# EAGLE design A slave stm32 (EAGLE 9.5.1)
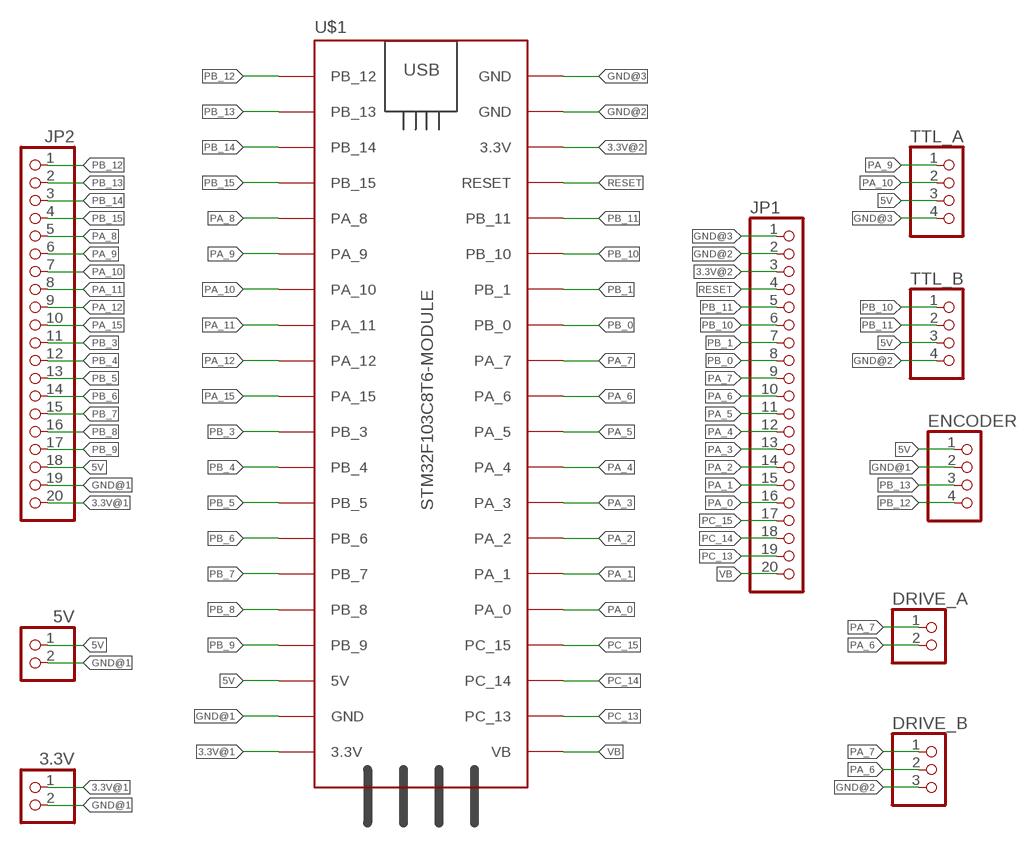
[diagram p0: schematic, sheet 1]

## Parts
3.3V  PINHD-2_DATA  [1X02_DATA]
5V  PINHD-2_DATA  [1X02_DATA]
DRIVE_A  PINHD-2_DATA  [1X02_DATA]
DRIVE_B  PINHD-3_DATA  [1X03_DATA]
ENCODER  PINHD-4_DATA  [1X04_DATA]
JP1  PINHD-1X20  [1X20]
JP2  PINHD-1X20  [1X20]
TTL_A  PINHD-4_DATA  [1X04_DATA]
TTL_B  PINHD-4_DATA  [1X04_DATA]
U$1  STM32F103C8T6-MODULE  [STM32F103C8T6-MODULE]

## Nets
3.3V@1: 3.3V.1 JP2.20 U$1.3.3V_1(3.3V)
3.3V@2: JP1.3 U$1.3.3V_2(3.3V)
5V: 5V.1 ENCODER.1 JP2.18 TTL_A.3 TTL_B.3 U$1.5V
GND@1: 3.3V.2 5V.2 ENCODER.2 JP2.19 U$1.GND_1(GND)
GND@2: DRIVE_B.3 JP1.2 TTL_B.4 U$1.GND_2(GND)
GND@3: JP1.1 TTL_A.4 U$1.GND_3(GND)
PA_0: JP1.16 U$1.PA_0
PA_1: JP1.15 U$1.PA_1
PA_2: JP1.14 U$1.PA_2
PA_3: JP1.13 U$1.PA_3
PA_4: JP1.12 U$1.PA_4
PA_5: JP1.11 U$1.PA_5
PA_6: DRIVE_A.2 DRIVE_B.2 JP1.10 U$1.PA_6
PA_7: DRIVE_A.1 DRIVE_B.1 JP1.9 U$1.PA_7
PA_8: JP2.5 U$1.PA_8
PA_9: JP2.6 TTL_A.1 U$1.PA_9
PA_10: JP2.7 TTL_A.2 U$1.PA_10
PA_11: JP2.8 U$1.PA_11
PA_12: JP2.9 U$1.PA_12
PA_15: JP2.10 U$1.PA_15
PB_0: JP1.8 U$1.PB_0
PB_1: JP1.7 U$1.PB_1
PB_3: JP2.11 U$1.PB_3
PB_4: JP2.12 U$1.PB_4
PB_5: JP2.13 U$1.PB_5
PB_6: JP2.14 U$1.PB_6
PB_7: JP2.15 U$1.PB_7
PB_8: JP2.16 U$1.PB_8
PB_9: JP2.17 U$1.PB_9
PB_10: JP1.6 TTL_B.1 U$1.PB_10
PB_11: JP1.5 TTL_B.2 U$1.PB_11
PB_12: ENCODER.4 JP2.1 U$1.PB_12
PB_13: ENCODER.3 JP2.2 U$1.PB_13
PB_14: JP2.3 U$1.PB_14
PB_15: JP2.4 U$1.PB_15
PC_13: JP1.19 U$1.PC_13
PC_14: JP1.18 U$1.PC_14
PC_15: JP1.17 U$1.PC_15
RESET: JP1.4 U$1.RESET
VB: JP1.20 U$1.VB

## Library data of the parts
3.3V 5V DRIVE_A = MIA_LIBRARY-2-2-2:PINHD-2_DATA: PIN HEADER
DRIVE_B = MIA_LIBRARY-2-2-2:PINHD-3_DATA: PIN HEADER
ENCODER TTL_A TTL_B = MIA_LIBRARY-2-2-2:PINHD-4_DATA: PIN HEADER
JP1 JP2 = MIA_LIBRARY-2-2-2:PINHD-1X20: PIN HEADER
U$1 = MIA_LIBRARY-2-2-2:STM32F103C8T6-MODULE: STM32F103C8T6 module with ARM Cortex-3, 20kB SRAM, 64kB Flash, 72MHz

## Board
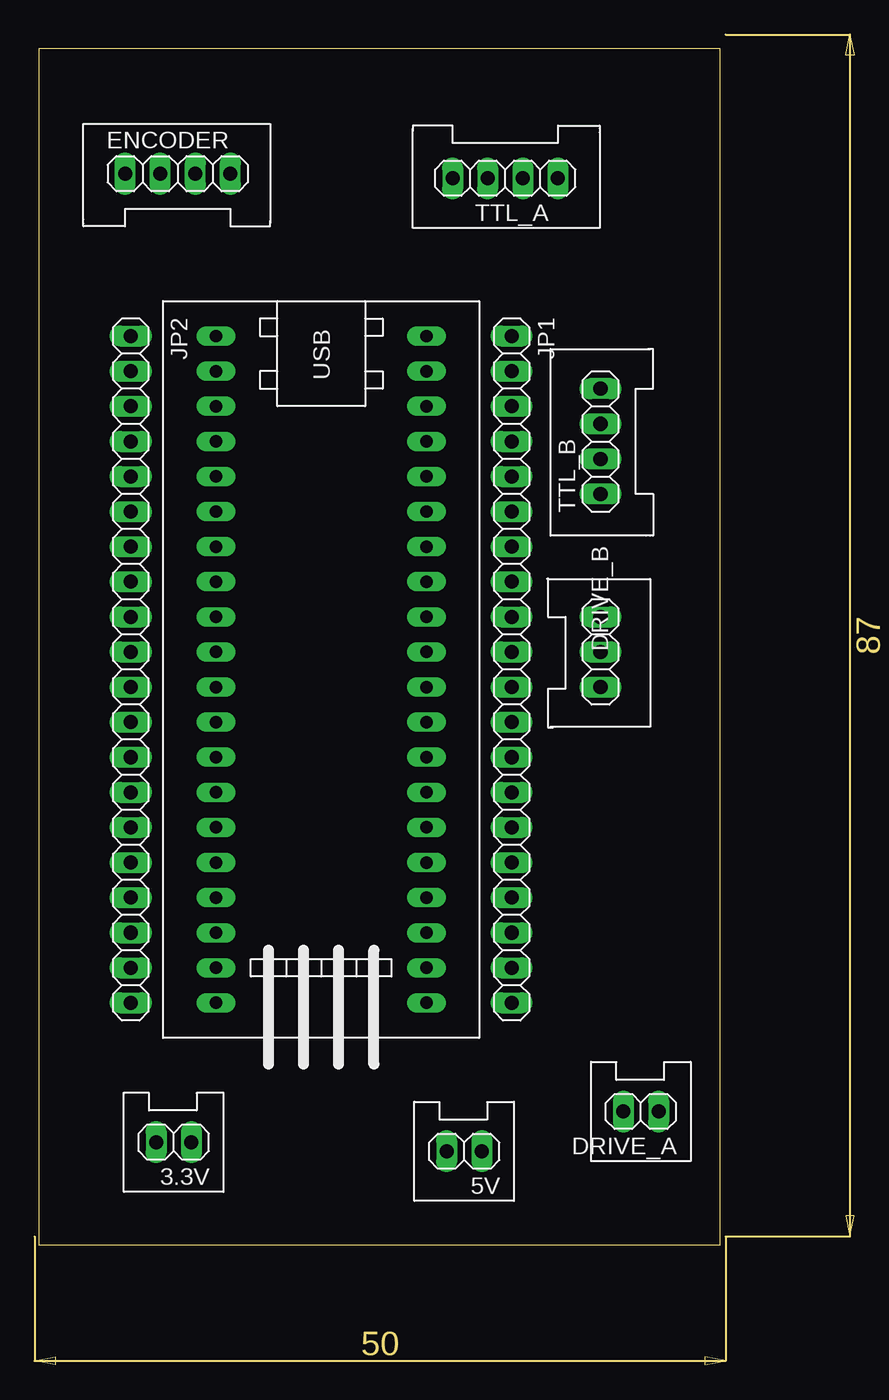
[diagram p1: board, top side]
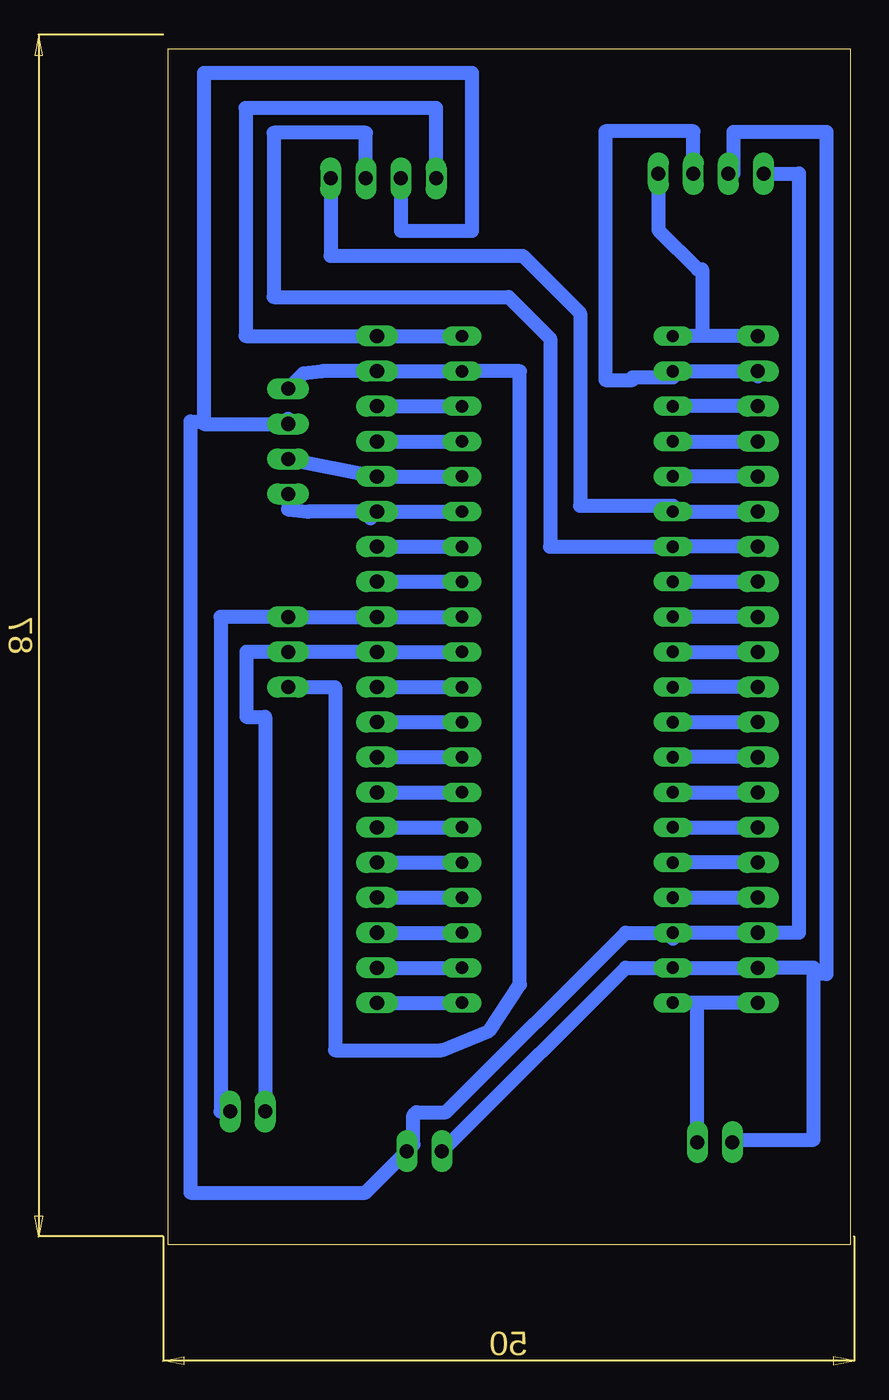
[diagram p2: board, bottom side, seen from below]

Size 49.34 x 86.57 mm. Coordinates in mm from the lower left corner, seen from the top.
Outline: 0,0 49.34,0 49.34,86.57 0,86.57 0,0
Copper layers (1*16): Top 0.035mm / dielectric 0.15mm / Bottom 0.035mm
Design rules "default *": minimum track width 1mm, minimum drill 0.35mm, track to track 0.8mm, track to pad 0.8mm, pad to pad 6mil, via to via 6mil, smd to smd 6mil, copper to edge 0.8mm, drill to drill 6mil, minimum pad ring 10mil, minimum via ring 8mil, stop-mask expansion 4mil, vias tented up to drill 0mil, thermal gap 10mil

### Footprints (pad centres in the part's own frame; a part is rotated, then mirrored left to right if it is on the bottom)
1X02_DATA = drill 1.016 long: 1 -1.27,0; 2 1.27,0
1X03_DATA = drill 1.016 long: 1 -2.54,0; 2 0,0; 3 2.54,0
1X04_DATA = drill 1.016 long: 1 -3.81,0; 2 -1.27,0; 3 1.27,0; 4 3.81,0
1X20 = drill 1.016 long: 1 -24.13,0; 2 -21.59,0; 3 -19.05,0; 4 -16.51,0; 5 -13.97,0; 6 -11.43,0; 7 -8.89,0; 8 -6.35,0; 9 -3.81,0; 10 -1.27,0; 11 1.27,0; 12 3.81,0; 13 6.35,0; 14 8.89,0; 15 11.43,0; 16 13.97,0; 17 16.51,0; 18 19.05,0; 19 21.59,0; 20 24.13,0
STM32F103C8T6-MODULE = drill 0.9 long: 3.3V_1 25.4,-7.62; 3.3V_2 -17.78,7.62; 5V 20.32,-7.62; GND_1 22.86,-7.62; GND_2 -20.32,7.62; GND_3 -22.86,7.62; PA_0 15.24,7.62; PA_1 12.7,7.62; PA_2 10.16,7.62; PA_3 7.62,7.62; PA_4 5.08,7.62; PA_5 2.54,7.62; PA_6 0,7.62; PA_7 -2.54,7.62; PA_8 -12.7,-7.62; PA_9 -10.16,-7.62; PA_10 -7.62,-7.62; PA_11 -5.08,-7.62; PA_12 -2.54,-7.62; PA_15 0,-7.62; PB_0 -5.08,7.62; PB_1 -7.62,7.62; PB_3 2.54,-7.62; PB_4 5.08,-7.62; PB_5 7.62,-7.62; PB_6 10.16,-7.62; PB_7 12.7,-7.62; PB_8 15.24,-7.62; PB_9 17.78,-7.62; PB_10 -10.16,7.62; PB_11 -12.7,7.62; PB_12 -22.86,-7.62; PB_13 -20.32,-7.62; PB_14 -17.78,-7.62; PB_15 -15.24,-7.62; PC_13 22.86,7.62; PC_14 20.32,7.62; PC_15 17.78,7.62; RESET -15.24,7.62; VB 25.4,7.62

### Placement (x,y rotation side)
3.3V  9.78,7.43 180 top
5V  30.8,6.77 180 top
DRIVE_A  43.59,9.65 180 top
DRIVE_B  40.66,42.91 270 top
ENCODER  10.07,77.53 0 top
JP1  34.23,41.64 270 top
JP2  6.67,41.64 270 top
TTL_A  33.77,77.2 180 top
TTL_B  40.66,58.15 90 top
U$1  20.45,42.91 270 top

### Tracks (layer width: path | path; a pad name or v marks a point on that pad's centre or on a via)
3.3V@1
  Bottom 1: 11.05,17.51 JP2.20 9.21,17.51 | 11.05,17.51 U$1.3.3V_1 | 3.3V.1 11.05,17.51
3.3V@2
  Bottom 1: JP1.3 U$1.3.3V_2
5V
  Bottom 1: U$1.5V JP2.18 3.71,22.59 3.71,77.53 ENCODER.1 | TTL_A.3 32.5,73.39 27.37,73.39 27.37,84.82 46.77,84.82 46.77,59.6 | 40.66,59.8 TTL_B.3 46.77,59.42 46.77,59.6 | 12.83,22.16 U$1.5V | 46.77,59.6 47.71,59.6 47.71,3.77 35.07,3.77 5V.1 31.59,7.25 31.59,9.39 31.38,9.59 29.25,9.59 16.25,22.59 U$1.5V
GND@1
  Bottom 1: 3.3V.2 8.51,7.6 2.64,7.6 2.64,19.6 | 2.64,19.6 2.64,20.05 JP2.19 U$1.GND_1 16.24,20.05 28.5,7.79 28.51,7.79 5V.2 | ENCODER.2 8.42,77.53 8.42,80.56 1.71,80.56 1.71,19.6 2.64,19.6
GND@2
  Bottom 1: DRIVE_B.3 37.26,40.37 37.26,14.08 29.55,14.08 26.11,15.5 23.89,18.83 23.89,63.23 U$1.GND_2 JP1.2 38.23,63.23 39.54,63.09 TTL_B.4
GND@3
  Bottom 1: U$1.GND_3 JP1.1 43.74,65.77 43.74,82.28 29.96,82.28 TTL_A.4
PA_0
  Bottom 1: JP1.16 U$1.PA_0
PA_1
  Bottom 1: JP1.15 U$1.PA_1
PA_2
  Bottom 1: JP1.14 U$1.PA_2
PA_3
  Bottom 1: JP1.13 U$1.PA_3
PA_4
  Bottom 1: JP1.12 U$1.PA_4
PA_5
  Bottom 1: JP1.11 U$1.PA_5
PA_6
  Bottom 1: U$1.PA_6 JP1.10 DRIVE_B.2 43.69,42.91 43.69,38.21 42.32,38.21 DRIVE_A.2
PA_7
  Bottom 1: U$1.PA_7 JP1.9 DRIVE_B.1 45.55,45.45 45.55,9.65 DRIVE_A.1
PA_8
  Bottom 1: JP2.5 U$1.PA_8
PA_9
  Bottom 1: JP2.6 U$1.PA_9 12.83,53.5 19.54,53.5 19.54,67.43 23.69,71.58 37.58,71.58 TTL_A.1
PA_10
  Bottom 1: JP2.7 U$1.PA_10 21.71,50.53 21.71,65.6 24.71,68.6 41.71,68.6 41.71,80.48 35.04,80.48 TTL_A.2
PA_11
  Bottom 1: U$1.PA_11 JP2.8
PA_12
  Bottom 1: JP2.9 U$1.PA_12
PA_15
  Bottom 1: U$1.PA_15 JP2.10
PB_0
  Bottom 1: JP1.8 U$1.PB_0
PB_1
  Bottom 1: JP1.7 U$1.PB_1
PB_3
  Bottom 1: JP2.11 U$1.PB_3
PB_4
  Bottom 1: U$1.PB_4 JP2.12
PB_5
  Bottom 1: JP2.13 U$1.PB_5
PB_6
  Bottom 1: U$1.PB_6 JP2.14
PB_7
  Bottom 1: U$1.PB_7 JP2.15
PB_8
  Bottom 1: JP2.16 U$1.PB_8
PB_9
  Bottom 1: U$1.PB_9 JP2.17
PB_10
  Bottom 1: JP1.6 U$1.PB_10 | 34.71,52.59 JP1.6 | JP1.6 39.23,53.07 40.66,53.23 TTL_B.1
PB_11
  Bottom 1: U$1.PB_11 JP1.5 TTL_B.2
PB_12
  Bottom 1: JP2.1 10.71,65.77 | 10.71,65.77 U$1.PB_12 | ENCODER.4 13.88,73.44 11.04,70.6 10.71,70.6 10.71,65.77
PB_13
  Bottom 1: 6.67,62.85 JP2.2 U$1.PB_13 12.83,62.8 15.74,62.8 15.74,62.6 17.71,62.6 17.71,80.6 11.34,80.6 ENCODER.3
PB_14
  Bottom 1: JP2.3 U$1.PB_14
PB_15
  Bottom 1: U$1.PB_15 JP2.4
PC_13
  Bottom 1: JP1.19 U$1.PC_13
PC_14
  Bottom 1: JP1.18 U$1.PC_14
PC_15
  Bottom 1: JP1.17 U$1.PC_15
RESET
  Bottom 1: JP1.4 U$1.RESET
VB
  Bottom 1: JP1.20 U$1.VB